# EAGLE schematic 1203_054 (EAGLE 7.1.0)

## Sheet 1 of 2
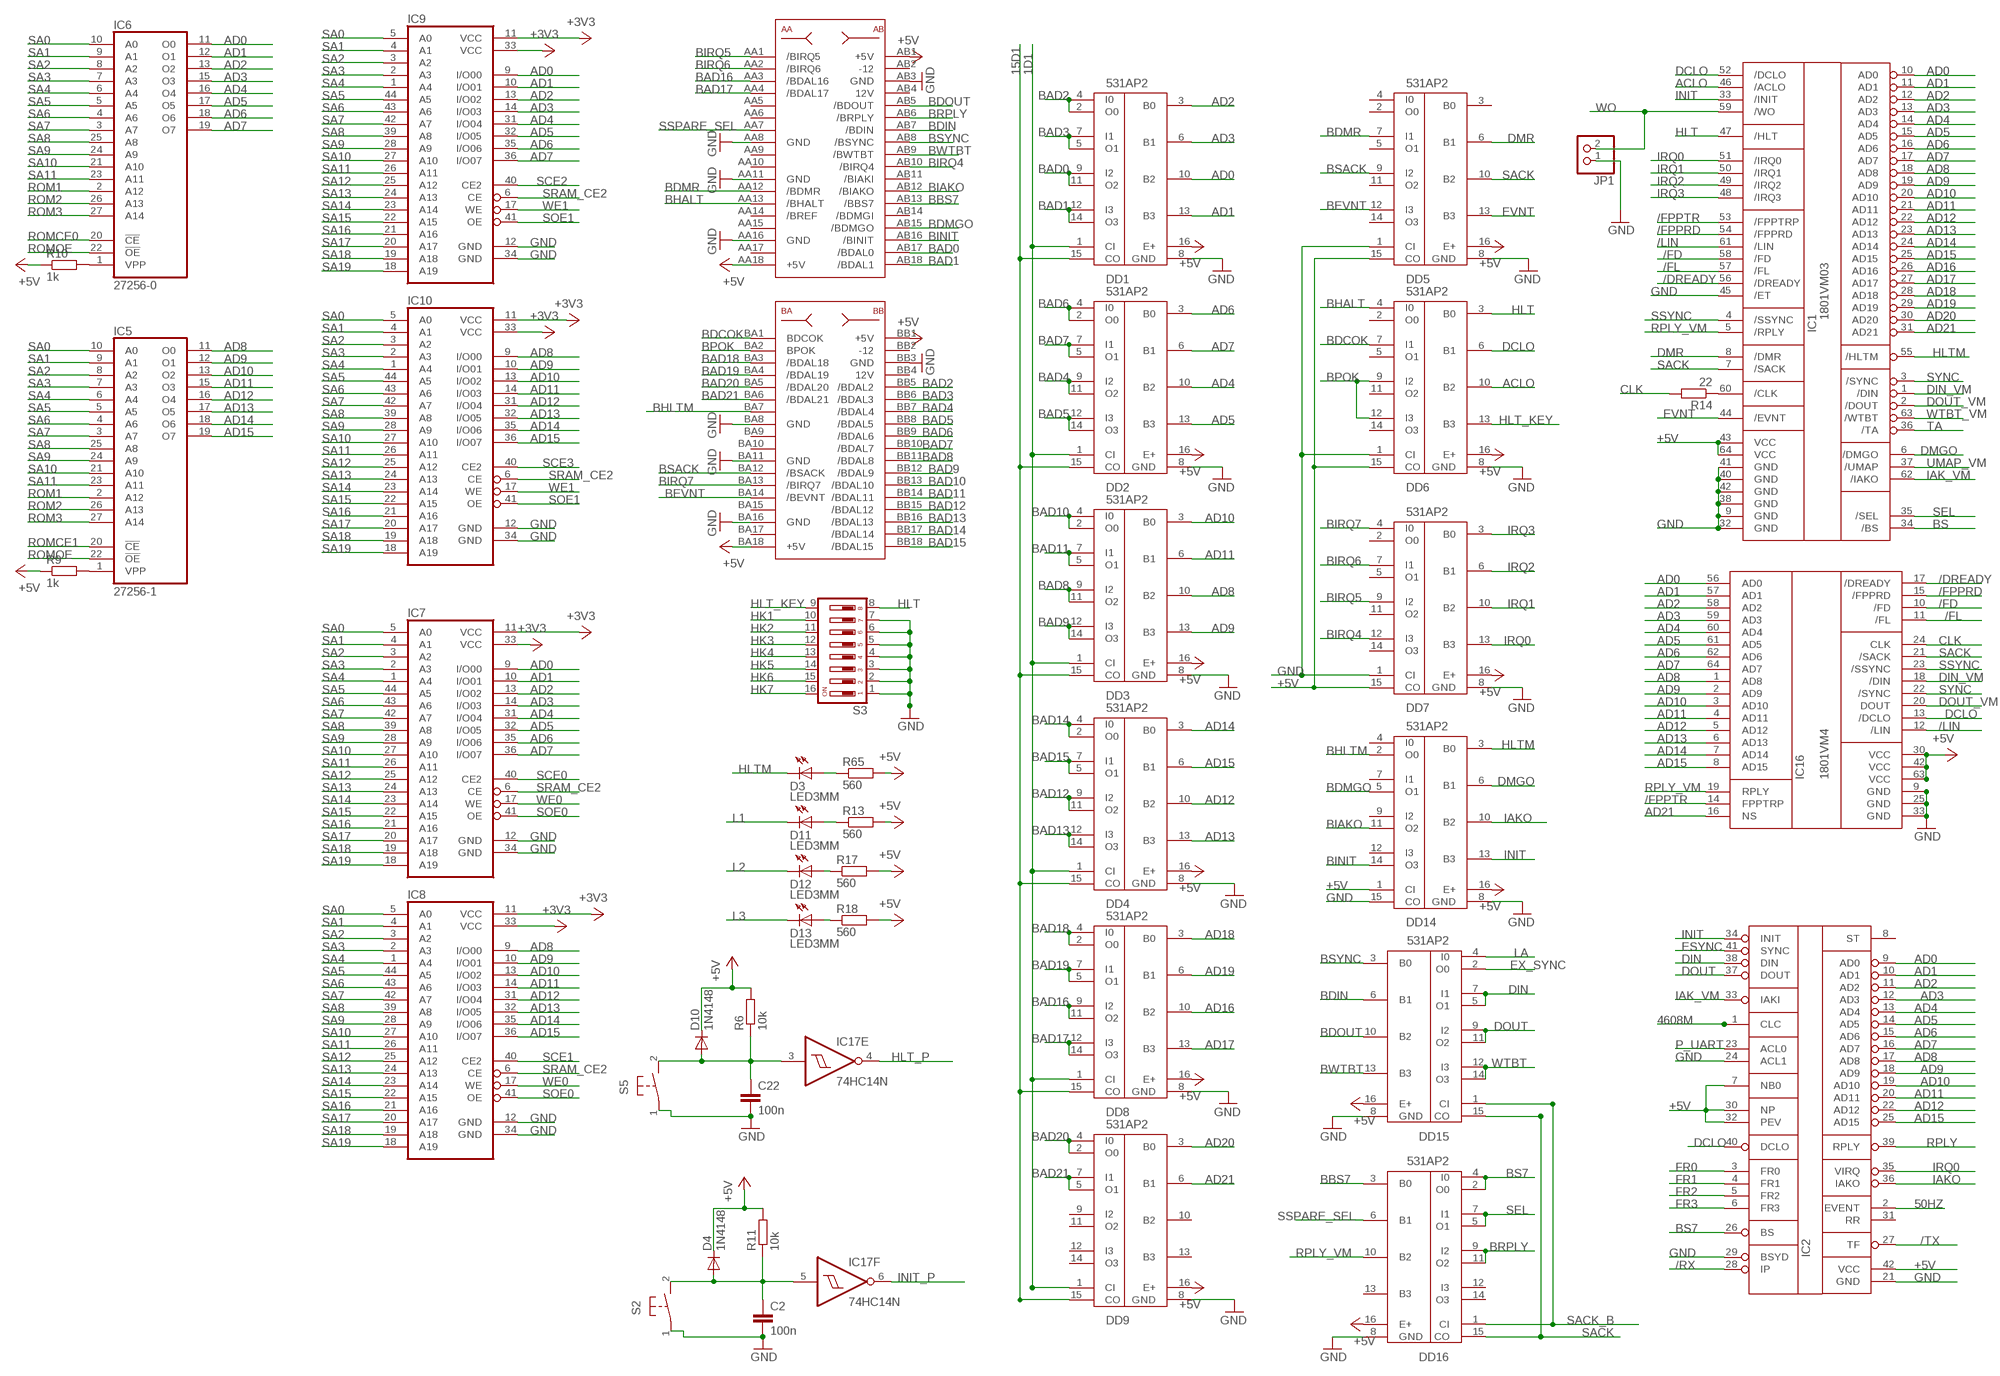
[diagram p0: schematic, sheet 1, part 1 of 2]
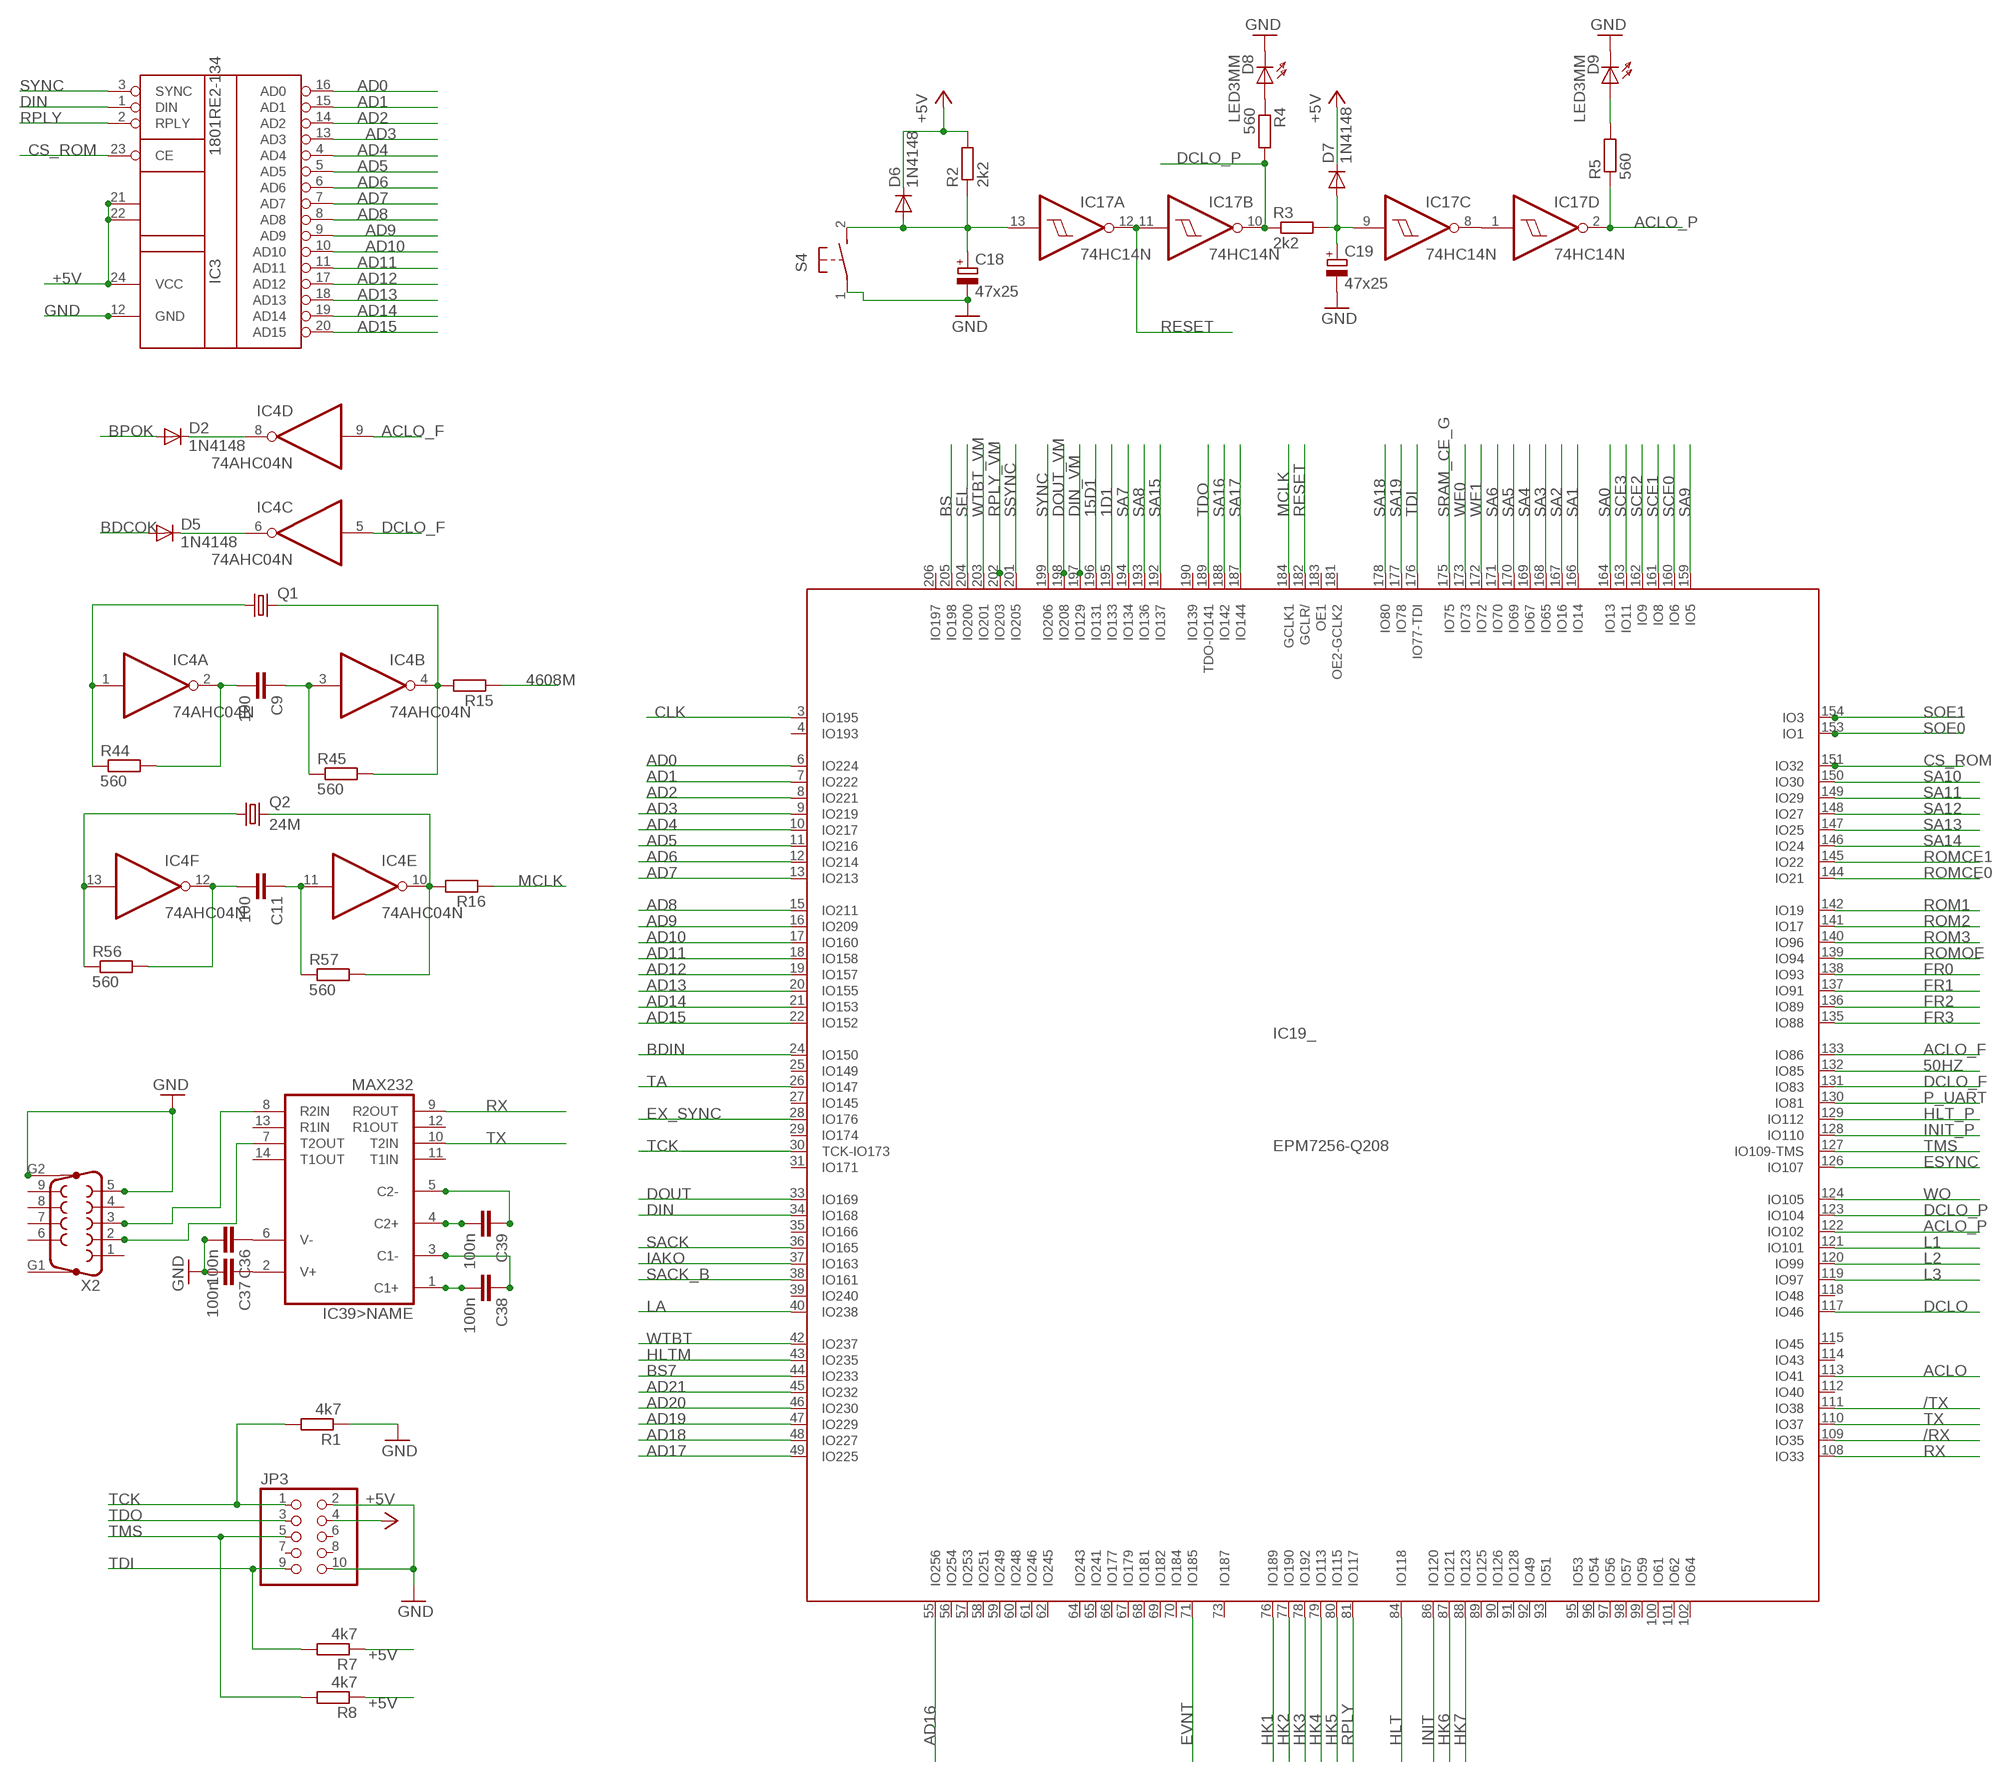
[diagram p1: schematic, sheet 1, part 2 of 2]

### Parts
C2  100n  C-EU050-024X044  [C050-024X044]
C9  100  C-EU025-024X044  [C025-024X044]
C11  100  C-EU025-024X044  [C025-024X044]
C18  47x25  CPOL-EUE2.5-5  [E2,5-5]
C19  47x25  CPOL-EUE2.5-5  [E2,5-5]
C22  100n  C-EU050-024X044  [C050-024X044]
C36  100n  C-EU025-024X044  [C025-024X044]
C37  100n  C-EU025-024X044  [C025-024X044]
C38  100n  C-EU025-024X044  [C025-024X044]
C39  100n  C-EU025-024X044  [C025-024X044]
D2  1N4148  [DO35-10]
D3  LED3MM  [LED3MM]
D4  1N4148  [DO35-10]
D5  1N4148  [DO35-10]
D6  1N4148  [DO35-10]
D7  1N4148  [DO35-10]
D8  LED3MM  [LED3MM]
D9  LED3MM  [LED3MM]
D10  1N4148  [DO35-10]
D11  LED3MM  [LED3MM]
D12  LED3MM  [LED3MM]
D13  LED3MM  [LED3MM]
DD1  531AP2  [DIL16]
DD2  531AP2  [DIL16]
DD3  531AP2  [DIL16]
DD4  531AP2  [DIL16]
DD5  531AP2  [DIL16]
DD6  531AP2  [DIL16]
DD7  531AP2  [DIL16]
DD8  531AP2  [DIL16]
DD9  531AP2  [DIL16]
DD14  531AP2  [DIL16]
DD15  531AP2  [DIL16]
DD16  531AP2  [DIL16]
IC1  1801VM03  1801M03  [DIL64]
IC2  1801VP1-065  [1801]
IC3  1801RE2-134  1801RE2  [DIL24]
IC4  74AHC04N  74ALS05N  [DIL14]
IC5  27256-1  27256  [DIL28]
IC6  27256-0  27256  [DIL28]
IC7  AS6C800855Z  [TSOP44]
IC8  AS6C800855Z  [TSOP44]
IC9  AS6C800855Z  [TSOP44]
IC10  AS6C800855Z  [TSOP44]
IC16  1801VM4  [1801VM4]
IC17  74HC14N  74AC14N  [DIL14]
IC19  EPM7256-Q208  [RQFP208]
IC39  MAX232  [DIL16]
JP1  PINHD-1X2  [1X02]
JP3  PINHD-2X5  [2X05]
Q1  HC49U70  [HC49U70]
Q2  24M  HC49U70  [HC49U70]
R1  4k7  R-EU_M0805  [M0805]
R2  2k2  R-EU_0207/10  [0207/10]
R3  2k2  R-EU_0207/10  [0207/10]
R4  560  R-EU_M0805  [M0805]
R5  560  R-EU_M0805  [M0805]
R6  10k  R-EU_0207/10  [0207/10]
R7  4k7  R-EU_M0805  [M0805]
R8  4k7  R-EU_M0805  [M0805]
R9  1k  R-EU_M0805  [M0805]
R10  1k  R-EU_M0805  [M0805]
R11  10k  R-EU_0207/10  [0207/10]
R13  560  R-EU_M0805  [M0805]
R14  22  R-EU_0204/2V  [0204V]
R15  R-EU_0204/2V  [0204V]
R16  R-EU_0204/2V  [0204V]
R17  560  R-EU_M0805  [M0805]
R18  560  R-EU_M0805  [M0805]
R44  560  R-EU_0204/2V  [0204V]
R45  560  R-EU_0204/2V  [0204V]
R56  560  R-EU_0204/2V  [0204V]
R57  560  R-EU_0204/2V  [0204V]
R65  560  R-EU_M0805  [M0805]
S2  31-XX  [B3F-31XX]
S3  DP08  [DP-08]
S4  31-XX  [B3F-31XX]
S5  31-XX  [B3F-31XX]
X2  F09HP  [F09HP]
XP1  CON1  [CON1]

### Nets
1D1: DD1.1(CI) DD2.1(CI) DD3.1(CI) DD4.1(CI) DD8.1(CI) DD9.1(CI) IC19.195(_:IO133) ; also sheet 2
15D1: DD1.15(CO) DD2.15(CO) DD3.15(CO) DD4.15(CO) DD8.15(CO) DD9.15(CO) IC19.196(_:IO131)
50HZ: IC2.2(EVENT) IC19.132(_:IO85)
4608M: IC2.1(CLC) R15.1
4608MM: IC4.10(E:O) Q2.2 R16.2 R57.2
+3V3: IC7.11(VCC) IC7.33(VCC) IC8.11(VCC) IC8.33(VCC) IC9.11(VCC) IC9.33(VCC) IC10.11(VCC) IC10.33(VCC) ; also sheet 2
+5V: D4.K(C) D6.K(C) D7.K(C) D10.K(C) DD1.16(E+) DD2.16(E+) DD3.16(E+) DD4.16(E+) DD5.15(CO) DD5.16(E+) DD6.15(CO) DD6.16(E+) DD7.15(CO) DD7.16(E+) DD8.16(E+) DD9.16(E+) DD14.1(CI) DD14.16(E+) DD15.16(E+) DD16.16(E+) IC1.43(VCC) IC1.64(VCC) IC2.7(NB0) IC2.30(NP) IC2.32(PEV) IC2.42(VCC) IC3.21(F0) IC3.22(F1) IC3.24(VCC) IC16.30(VCC) IC16.42(VCC) IC16.63(VCC) JP3.4 R2.2 R6.2 R7.1 R8.1 R9.1 R10.1 R11.2 R13.2 R17.2 R18.2 R65.2 XP1.AA18(+5V) XP1.AB1(+5V) XP1.BA18(+5V) XP1.BB1(+5V) ; also sheet 2
/DREADY: IC1.56(/DREADY) IC16.17(/DREADY) ; also sheet 2
/FD: IC1.58(/FD) IC16.10(/FD) ; also sheet 2
/FL: IC1.57(/FL) IC16.11(/FL) ; also sheet 2
/FPPRD: IC1.54(/FPPRD) IC16.15(/FPPRD) ; also sheet 2
/FPPTR: IC1.53(/FPPTRP) IC16.14(FPPTRP) ; also sheet 2
/LIN: IC1.61(/LIN) IC16.12(/LIN) ; also sheet 2
/RX: IC2.28(IP) IC19.109(_:IO35)
/TX: IC2.27(TF) IC19.111(_:IO38)
ACLO: DD6.10(B2) IC1.46(/ACLO) IC19.113(_:IO41) ; also sheet 2
ACLO_F: IC4.9(D:I) IC19.133(_:IO86)
ACLO_P: IC17.2(D:O) IC19.122(_:IO102) R5.1
AD0: DD1.10(B2) IC1.10(AD0) IC2.9(AD0) IC3.16(AD0) IC6.11(O0) IC7.9(I/O00) IC9.9(I/O00) IC16.56(AD0) IC19.6(_:IO224) ; also sheet 2
AD1: DD1.13(B3) IC1.11(AD1) IC2.10(AD1) IC3.15(AD1) IC6.12(O1) IC7.10(I/O01) IC9.10(I/O01) IC16.57(AD1) IC19.7(_:IO222) ; also sheet 2
AD2: DD1.3(B0) IC1.12(AD2) IC2.11(AD2) IC3.14(AD2) IC6.13(O2) IC7.13(I/O02) IC9.13(I/O02) IC16.58(AD2) IC19.8(_:IO221) ; also sheet 2
AD3: DD1.6(B1) IC1.13(AD3) IC2.12(AD3) IC3.13(AD3) IC6.15(O3) IC7.14(I/O03) IC9.14(I/O03) IC16.59(AD3) IC19.9(_:IO219) ; also sheet 2
AD4: DD2.10(B2) IC1.14(AD4) IC2.13(AD4) IC3.4(AD4) IC6.16(O4) IC7.31(I/O04) IC9.31(I/O04) IC16.60(AD4) IC19.10(_:IO217) ; also sheet 2
AD5: DD2.13(B3) IC1.15(AD5) IC2.14(AD5) IC3.5(AD5) IC6.17(O5) IC7.32(I/O05) IC9.32(I/O05) IC16.61(AD5) IC19.11(_:IO216) ; also sheet 2
AD6: DD2.3(B0) IC1.16(AD6) IC2.15(AD6) IC3.6(AD6) IC6.18(O6) IC7.35(I/O06) IC9.35(I/O06) IC16.62(AD6) IC19.12(_:IO214) ; also sheet 2
AD7: DD2.6(B1) IC1.17(AD7) IC2.16(AD7) IC3.7(AD7) IC6.19(O7) IC7.36(I/O07) IC9.36(I/O07) IC16.64(AD7) IC19.13(_:IO213) ; also sheet 2
AD8: DD3.10(B2) IC1.18(AD8) IC2.17(AD8) IC3.8(AD8) IC5.11(O0) IC8.9(I/O00) IC10.9(I/O00) IC16.1(AD8) IC19.15(_:IO211) ; also sheet 2
AD9: DD3.13(B3) IC1.19(AD9) IC2.18(AD9) IC3.9(AD9) IC5.12(O1) IC8.10(I/O01) IC10.10(I/O01) IC16.2(AD9) IC19.16(_:IO209) ; also sheet 2
AD10: DD3.3(B0) IC1.20(AD10) IC2.19(AD10) IC3.10(AD10) IC5.13(O2) IC8.13(I/O02) IC10.13(I/O02) IC16.3(AD10) IC19.17(_:IO160) ; also sheet 2
AD11: DD3.6(B1) IC1.21(AD11) IC2.20(AD11) IC3.11(AD11) IC5.15(O3) IC8.14(I/O03) IC10.14(I/O03) IC16.4(AD11) IC19.18(_:IO158) ; also sheet 2
AD12: DD4.10(B2) IC1.22(AD12) IC2.22(AD12) IC3.17(AD12) IC5.16(O4) IC8.31(I/O04) IC10.31(I/O04) IC16.5(AD12) IC19.19(_:IO157) ; also sheet 2
AD13: DD4.13(B3) IC1.23(AD13) IC3.18(AD13) IC5.17(O5) IC8.32(I/O05) IC10.32(I/O05) IC16.6(AD13) IC19.20(_:IO155) ; also sheet 2
AD14: DD4.3(B0) IC1.24(AD14) IC3.19(AD14) IC5.18(O6) IC8.35(I/O06) IC10.35(I/O06) IC16.7(AD14) IC19.21(_:IO153) ; also sheet 2
AD15: DD4.6(B1) IC1.25(AD15) IC2.25(AD15) IC3.20(AD15) IC5.19(O7) IC8.36(I/O07) IC10.36(I/O07) IC16.8(AD15) IC19.22(_:IO152) ; also sheet 2
AD16: DD8.10(B2) IC1.26(AD16) IC19.55(_:IO256) ; also sheet 2
AD17: DD8.13(B3) IC1.27(AD17) IC19.49(_:IO225) ; also sheet 2
AD18: DD8.3(B0) IC1.28(AD18) IC19.48(_:IO227) ; also sheet 2
AD19: DD8.6(B1) IC1.29(AD19) IC19.47(_:IO229) ; also sheet 2
AD20: DD9.3(B0) IC1.30(AD20) IC19.46(_:IO230) ; also sheet 2
AD21: DD9.6(B1) IC1.31(AD21) IC16.16(NS) IC19.45(_:IO232) ; also sheet 2
BAD0: DD1.9(I2) DD1.11(O2) XP1.AB17(/BDAL0) ; also sheet 2
BAD1: DD1.12(I3) DD1.14(O3) XP1.AB18(/BDAL1) ; also sheet 2
BAD2: DD1.2(O0) DD1.4(I0) XP1.BB5(/BDAL2) ; also sheet 2
BAD3: DD1.5(O1) DD1.7(I1) XP1.BB6(/BDAL3) ; also sheet 2
BAD4: DD2.9(I2) DD2.11(O2) XP1.BB7(/BDAL4) ; also sheet 2
BAD5: DD2.12(I3) DD2.14(O3) XP1.BB8(/BDAL5) ; also sheet 2
BAD6: DD2.2(O0) DD2.4(I0) XP1.BB9(/BDAL6) ; also sheet 2
BAD7: DD2.5(O1) DD2.7(I1) XP1.BB10(/BDAL7) ; also sheet 2
BAD8: DD3.9(I2) DD3.11(O2) XP1.BB11(/BDAL8) ; also sheet 2
BAD9: DD3.12(I3) DD3.14(O3) XP1.BB12(/BDAL9) ; also sheet 2
BAD10: DD3.2(O0) DD3.4(I0) XP1.BB13(/BDAL10) ; also sheet 2
BAD11: DD3.5(O1) DD3.7(I1) XP1.BB14(/BDAL11) ; also sheet 2
BAD12: DD4.9(I2) DD4.11(O2) XP1.BB15(/BDAL12) ; also sheet 2
BAD13: DD4.12(I3) DD4.14(O3) XP1.BB16(/BDAL13) ; also sheet 2
BAD14: DD4.2(O0) DD4.4(I0) XP1.BB17(/BDAL14) ; also sheet 2
BAD15: DD4.5(O1) DD4.7(I1) XP1.BB18(/BDAL15) ; also sheet 2
BAD16: DD8.9(I2) DD8.11(O2) XP1.AA3(/BDAL16) ; also sheet 2
BAD17: DD8.12(I3) DD8.14(O3) XP1.AA4(/BDAL17) ; also sheet 2
BAD18: DD8.2(O0) DD8.4(I0) XP1.BA3(/BDAL18) ; also sheet 2
BAD19: DD8.5(O1) DD8.7(I1) XP1.BA4(/BDAL19) ; also sheet 2
BAD20: DD9.2(O0) DD9.4(I0) XP1.BA5(/BDAL20) ; also sheet 2
BAD21: DD9.5(O1) DD9.7(I1) XP1.BA6(/BDAL21) ; also sheet 2
BBS7: DD16.3(B0) XP1.AB13(/BBS7) ; also sheet 2
BDCOK: D5.A DD6.7(I1) XP1.BA1(BDCOK) ; also sheet 2
BDIN: DD15.6(B1) IC19.24(_:IO150) XP1.AB7(/BDIN) ; also sheet 2
BDMGO: DD14.5(O1) XP1.AB15(/BDMGO) ; also sheet 2
BDMR: DD5.7(I1) XP1.AA12(/BDMR) ; also sheet 2
BDOUT: DD15.10(B2) XP1.AB5(/BDOUT) ; also sheet 2
BEVNT: DD5.12(I3) XP1.BA14(/BEVNT) ; also sheet 2
BHALT: DD6.4(I0) XP1.AA13(/BHALT) ; also sheet 2
BHLTM: DD14.2(O0) XP1.BA7 ; also sheet 2
BIAKO: DD14.11(O2) XP1.AB12(/BIAKO) ; also sheet 2
BINIT: DD14.14(O3) XP1.AB16(/BINIT) ; also sheet 2
BIRQ4: DD7.12(I3) XP1.AB10(/BIRQ4) ; also sheet 2
BIRQ5: DD7.9(I2) XP1.AA1(/BIRQ5) ; also sheet 2
BIRQ6: DD7.7(I1) XP1.AA2(/BIRQ6) ; also sheet 2
BIRQ7: DD7.4(I0) XP1.BA13(/BIRQ7) ; also sheet 2
BPOK: D2.A DD6.9(I2) DD6.12(I3) XP1.BA2(BPOK) ; also sheet 2
BRPLY: DD16.9(I2) DD16.11(O2) XP1.AB6(/BRPLY) ; also sheet 2
BS: IC1.34(/BS) IC19.205(_:IO198) ; also sheet 2
BS7: DD16.2(O0) DD16.4(I0) IC2.26(BS) IC19.44(_:IO233) ; also sheet 2
BSACK: DD5.9(I2) XP1.BA12(/BSACK) ; also sheet 2
BSYNC: DD15.3(B0) XP1.AB8(/BSYNC) ; also sheet 2
BWTBT: DD15.13(B3) XP1.AB9(/BWTBT) ; also sheet 2
CLK: IC16.24(CLK) IC19.3(_:IO195) R14.2
CS_ROM: IC3.23(CE) IC19.151(_:IO32)
DCLO: DD6.6(B1) IC1.52(/DCLO) IC2.40(DCLO) IC16.13(/DCLO) IC19.117(_:IO46) ; also sheet 2
DCLO_F: IC4.5(C:I) IC19.131(_:IO83)
DCLO_P: IC17.10(B:O) IC19.123(_:IO104) R3.1 R4.2
DIN: DD15.5(O1) DD15.7(I1) IC2.38(DIN) IC3.1(DIN) IC19.34(_:IO168) ; also sheet 2
DIN_VM: IC1.1(/DIN) IC16.18(/DIN) IC19.197(_:IO129) ; also sheet 2
DMGO: DD14.6(B1) IC1.6(/DMGO) ; also sheet 2
DMR: DD5.6(B1) IC1.8(/DMR) ; also sheet 2
DOUT: DD15.9(I2) DD15.11(O2) IC2.37(DOUT) IC19.33(_:IO169) ; also sheet 2
DOUT_VM: IC1.2(/DOUT) IC16.20(DOUT) IC19.198(_:IO208) ; also sheet 2
ESYNC: IC2.41(SYNC) IC19.126(_:IO107)
EVNT: DD5.13(B3) IC1.44(/EVNT) IC19.71(_:IO185) ; also sheet 2
EX_SYNC: DD15.2(O0) IC19.28(_:IO176) ; also sheet 2
FR0: IC2.3(FR0) IC19.138(_:IO93)
FR1: IC2.4(FR1) IC19.137(_:IO91)
FR2: IC2.5(FR2) IC19.136(_:IO89)
FR3: IC2.6(FR3) IC19.135(_:IO88)
GND: C2.2 C18.- C19.- C22.2 C36.2 C37.2 D8.K(C) D9.K(C) DD1.8(GND) DD2.8(GND) DD3.8(GND) DD4.8(GND) DD5.1(CI) DD5.8(GND) DD6.1(CI) DD6.8(GND) DD7.1(CI) DD7.8(GND) DD8.8(GND) DD9.8(GND) DD14.8(GND) DD14.15(CO) DD15.8(GND) DD16.8(GND) IC1.9(GND) IC1.32(GND) IC1.38(GND) IC1.40(GND) IC1.41(GND) IC1.42(GND) IC1.45(/ET) IC2.21(GND) IC2.24(ACL1) IC2.29(BSYD) IC3.12(GND) IC7.12(GND) IC7.34(GND) IC8.12(GND) IC8.34(GND) IC9.12(GND) IC9.34(GND) IC10.12(GND) IC10.34(GND) IC16.9(GND) IC16.25(GND) IC16.33(GND) JP1.1 JP3.2 JP3.10 R1.1 S2.1 S3.1 S3.2 S3.3 S3.4 S3.5 S3.6 S3.7 S4.1 S5.1 X2.5 X2.G2 XP1.AA8(GND) XP1.AA11(GND) XP1.AA16(GND) XP1.AB3(GND) XP1.BA8(GND) XP1.BA11(GND) XP1.BA16(GND) XP1.BB3(GND) ; also sheet 2
HK1: IC19.76(_:IO189) S3.10 ; also sheet 2
HK2: IC19.77(_:IO190) S3.11 ; also sheet 2
HK3: IC19.78(_:IO192) S3.12 ; also sheet 2
HK4: IC19.79(_:IO113) S3.13 ; also sheet 2
HK5: IC19.80(_:IO115) S3.14 ; also sheet 2
HK6: IC19.87(_:IO121) S3.15 ; also sheet 2
HK7: IC19.88(_:IO123) S3.16 ; also sheet 2
HLT: DD6.3(B0) IC1.47(/HLT) IC19.84(_:IO118) S3.8 ; also sheet 2
HLT_KEY: DD6.13(B3) S3.9
HLT_P: IC17.4(E:O) IC19.129(_:IO112)
HLTM: D3.K(C) DD14.3(B0) IC1.55(/HLTM) IC19.43(_:IO235) ; also sheet 2
IAK_VM: IC1.62(/IAKO) IC2.33(IAKI) ; also sheet 2
IAKO: DD14.10(B2) IC2.36(IAKO) IC19.37(_:IO163)
INIT: DD14.13(B3) IC1.33(/INIT) IC2.34(INIT) IC19.86(_:IO120) ; also sheet 2
INIT_P: IC17.6(F:O) IC19.128(_:IO110)
IRQ0: DD7.13(B3) IC1.51(/IRQ0) IC2.35(VIRQ) ; also sheet 2
IRQ1: DD7.10(B2) IC1.50(/IRQ1) ; also sheet 2
IRQ2: DD7.6(B1) IC1.49(/IRQ2) ; also sheet 2
IRQ3: DD7.3(B0) IC1.48(/IRQ3) ; also sheet 2
L1: D11.K(C) IC19.121(_:IO101)
L2: D12.K(C) IC19.120(_:IO99)
L3: D13.K(C) IC19.119(_:IO97)
LA: DD15.4(I0) IC19.40(_:IO238)
MCLK: IC19.184(_:GCLK1) R16.1
MCLKK: IC4.4(B:O) Q1.2 R15.2 R45.2
N$2: IC6.1(VPP) R10.2
N$3: IC17.1(D:I) IC17.8(C:O)
N$4: C38.1 IC39.3(>NAME:C1-)
N$5: D9.A R5.2
N$6: C18.+ D6.A IC17.13(A:I) R2.1 S4.2
N$7: IC4.1(A:I) Q1.1 R44.1
N$8: D3.A R65.1
N$82: C9.2 IC4.2(A:O) R44.2
N$83: C19.+ D7.A IC17.9(C:I) R3.2
N$84: D8.A R4.1
N$85: IC5.1(VPP) R9.2
N$86: C22.1 D10.A IC17.3(E:I) R6.1 S5.2
N$87: D11.A R13.1
N$88: IC1.60(/CLK) R14.1
N$90: D2.K(C) IC4.8(D:O)
N$91: D5.K(C) IC4.6(C:O)
N$92: C2.1 D4.A IC17.5(F:I) R11.1 S2.2
N$93: D12.A R17.1
N$94: D13.A R18.1
N$96: IC4.13(F:I) Q2.1 R56.1
N$127: C9.1 IC4.3(B:I) R45.1
N$136: C38.2 IC39.1(>NAME:C1+)
N$139: C39.2 IC39.4(>NAME:C2+)
N$140: C39.1 IC39.5(>NAME:C2-)
N$141: IC39.7(>NAME:T2OUT) X2.2
N$142: IC39.8(>NAME:R2IN) X2.3
N$143: C36.1 IC39.6(>NAME:V-)
N$144: C37.1 IC39.2(>NAME:V+)
N$148: C11.2 IC4.12(F:O) R56.2
N$149: C11.1 IC4.11(E:I) R57.1
P_UART: IC2.23(ACL0) IC19.130(_:IO81)
RESET: IC17.11(B:I) IC17.12(A:O) IC19.182(_:GCLR/)
ROM1: IC5.2(A12) IC6.2(A12) IC19.142(_:IO19)
ROM2: IC5.26(A13) IC6.26(A13) IC19.141(_:IO17)
ROM3: IC5.27(A14) IC6.27(A14) IC19.140(_:IO96)
ROMCE0: IC6.20(!CE) IC19.144(_:IO21)
ROMCE1: IC5.20(!CE) IC19.145(_:IO22)
ROMOE: IC5.22(!OE) IC6.22(!OE) IC19.139(_:IO94)
RPLY: IC2.39(RPLY) IC3.2(RPLY) IC19.81(_:IO117) ; also sheet 2
RPLY_VM: DD16.10(B2) IC1.5(/RPLY) IC16.19(RPLY) IC19.202(_:IO203) ; also sheet 2
RX: IC19.108(_:IO33) IC39.9(>NAME:R2OUT)
SA0: IC5.10(A0) IC6.10(A0) IC7.5(A0) IC8.5(A0) IC9.5(A0) IC10.5(A0) IC19.164(_:IO13)
SA1: IC5.9(A1) IC6.9(A1) IC7.4(A1) IC8.4(A1) IC9.4(A1) IC10.4(A1) IC19.166(_:IO14)
SA2: IC5.8(A2) IC6.8(A2) IC7.3(A2) IC8.3(A2) IC9.3(A2) IC10.3(A2) IC19.167(_:IO16)
SA3: IC5.7(A3) IC6.7(A3) IC7.2(A3) IC8.2(A3) IC9.2(A3) IC10.2(A3) IC19.168(_:IO65)
SA4: IC5.6(A4) IC6.6(A4) IC7.1(A4) IC8.1(A4) IC9.1(A4) IC10.1(A4) IC19.169(_:IO67)
SA5: IC5.5(A5) IC6.5(A5) IC7.44(A5) IC8.44(A5) IC9.44(A5) IC10.44(A5) IC19.170(_:IO69)
SA6: IC5.4(A6) IC6.4(A6) IC7.43(A6) IC8.43(A6) IC9.43(A6) IC10.43(A6) IC19.171(_:IO70)
SA7: IC5.3(A7) IC6.3(A7) IC7.42(A7) IC8.42(A7) IC9.42(A7) IC10.42(A7) IC19.194(_:IO134)
SA8: IC5.25(A8) IC6.25(A8) IC7.39(A8) IC8.39(A8) IC9.39(A8) IC10.39(A8) IC19.193(_:IO136)
SA9: IC5.24(A9) IC6.24(A9) IC7.28(A9) IC8.28(A9) IC9.28(A9) IC10.28(A9) IC19.159(_:IO5)
SA10: IC5.21(A10) IC6.21(A10) IC7.27(A10) IC8.27(A10) IC9.27(A10) IC10.27(A10) IC19.150(_:IO30)
SA11: IC5.23(A11) IC6.23(A11) IC7.26(A11) IC8.26(A11) IC9.26(A11) IC10.26(A11) IC19.149(_:IO29)
SA12: IC7.25(A12) IC8.25(A12) IC9.25(A12) IC10.25(A12) IC19.148(_:IO27)
SA13: IC7.24(A13) IC8.24(A13) IC9.24(A13) IC10.24(A13) IC19.147(_:IO25)
SA14: IC7.23(A14) IC8.23(A14) IC9.23(A14) IC10.23(A14) IC19.146(_:IO24)
SA15: IC7.22(A15) IC8.22(A15) IC9.22(A15) IC10.22(A15) IC19.192(_:IO137)
SA16: IC7.21(A16) IC8.21(A16) IC9.21(A16) IC10.21(A16) IC19.188(_:IO142)
SA17: IC7.20(A17) IC8.20(A17) IC9.20(A17) IC10.20(A17) IC19.187(_:IO144)
SA18: IC7.19(A18) IC8.19(A18) IC9.19(A18) IC10.19(A18) IC19.178(_:IO80)
SA19: IC7.18(A19) IC8.18(A19) IC9.18(A19) IC10.18(A19) IC19.177(_:IO78)
SACK: DD5.10(B2) DD15.15(CO) DD16.15(CO) IC1.7(/SACK) IC16.21(/SACK) IC19.36(_:IO165) ; also sheet 2
SACK_B: DD15.1(CI) DD16.1(CI) IC19.38(_:IO161)
SCE0: IC7.40(CE2) IC19.160(_:IO6)
SCE1: IC8.40(CE2) IC19.161(_:IO8)
SCE2: IC9.40(CE2) IC19.162(_:IO9)
SCE3: IC10.40(CE2) IC19.163(_:IO11)
SEL: DD16.5(O1) DD16.7(I1) IC1.35(/SEL) IC19.204(_:IO200) ; also sheet 2
SOE0: IC7.41(OE) IC8.41(OE) IC19.153(_:IO1)
SOE1: IC9.41(OE) IC10.41(OE) IC19.154(_:IO3)
SRAM_CE2: IC7.6(CE) IC8.6(CE) IC9.6(CE) IC10.6(CE) ; also sheet 2
SRAM_CE_G: IC19.175(_:IO75) ; also sheet 2
SSPARE_SEL: DD16.6(B1) XP1.AA7 ; also sheet 2
SSYNC: IC1.4(/SSYNC) IC16.23(/SSYNC) IC19.201(_:IO205) ; also sheet 2
SYNC: IC1.3(/SYNC) IC3.3(SYNC) IC16.22(/SYNC) IC19.199(_:IO206) ; also sheet 2
TA: IC1.36(/TA) IC19.26(_:IO147) ; also sheet 2
TCK: IC19.30(_:TCK-IO173) JP3.1 R1.2
TDI: IC19.176(_:IO77-TDI) JP3.9 R7.2
TDO: IC19.189(_:TDO-IO141) JP3.3
TMS: IC19.127(_:IO109-TMS) JP3.5 R8.2
TX: IC19.110(_:IO37) IC39.10(>NAME:T2IN)
UMAP_VM: IC1.37(/UMAP) ; also sheet 2
WE0: IC7.17(WE) IC8.17(WE) IC19.173(_:IO73)
WE1: IC9.17(WE) IC10.17(WE) IC19.172(_:IO72)
WO: IC1.59(/WO) IC19.124(_:IO105) JP1.2 ; also sheet 2
WTBT: DD15.12(I3) DD15.14(O3) IC19.42(_:IO237) ; also sheet 2
WTBT_VM: IC1.63(/WTBT) IC19.203(_:IO201) ; also sheet 2
Unconnected: DD5.2(O0) DD5.3(B0) DD5.4(I0) DD5.5(O1) DD5.11(O2) DD5.14(O3) DD6.2(O0) DD6.5(O1) DD6.11(O2) DD6.14(O3) DD7.2(O0) DD7.5(O1) DD7.11(O2) DD7.14(O3) DD9.9(I2) DD9.10(B2) DD9.11(O2) DD9.12(I3) DD9.13(B3) DD9.14(O3) DD14.4(I0) DD14.7(I1) DD14.9(I2) DD14.12(I3) DD16.12(I3) DD16.13(B3) DD16.14(O3) IC2.8(ST) IC2.31(RR) IC19.1(NC1:NC) IC19.2(NC2:NC) IC19.4(_:IO193) IC19.25(_:IO149) IC19.27(_:IO145) IC19.29(_:IO174) IC19.31(_:IO171) IC19.35(_:IO166) IC19.39(_:IO240) IC19.51(NC3:NC) IC19.52(NC4:NC) IC19.53(NC5:NC) IC19.54(NC6:NC) IC19.56(_:IO254) IC19.57(_:IO253) IC19.58(_:IO251) IC19.59(_:IO249) IC19.60(_:IO248) IC19.61(_:IO246) IC19.62(_:IO245) IC19.64(_:IO243) IC19.65(_:IO241) IC19.66(_:IO177) IC19.67(_:IO179) IC19.68(_:IO181) IC19.69(_:IO182) IC19.70(_:IO184) IC19.73(_:IO187) IC19.89(_:IO125) IC19.90(_:IO126) IC19.91(_:IO128) IC19.92(_:IO49) IC19.93(_:IO51) IC19.95(_:IO53) IC19.96(_:IO54) IC19.97(_:IO56) IC19.98(_:IO57) IC19.99(_:IO59) IC19.100(_:IO61) IC19.101(_:IO62) IC19.102(_:IO64) IC19.103(NC7:NC) IC19.104(NC8:NC) IC19.105(NC9:NC) IC19.106(NC10:NC) IC19.112(_:IO40) IC19.114(_:IO43) IC19.115(_:IO45) IC19.118(_:IO48) IC19.155(NC11:NC) IC19.156(NC12:NC) IC19.157(NC13:NC) IC19.158(NC14:NC) IC19.181(_:OE2-GCLK2) IC19.183(_:OE1) IC19.190(_:IO139) IC19.206(_:IO197) IC19.207(NC15:NC) IC19.208(NC16:NC) IC39.11(>NAME:T1IN) IC39.12(>NAME:R1OUT) IC39.13(>NAME:R1IN) IC39.14(>NAME:T1OUT) IC39.15(P:GND) IC39.16(P:+5V) JP3.6 JP3.7 JP3.8 X2.1 X2.4 X2.6 X2.7 X2.8 X2.9 X2.G1 XP1.AA5 XP1.AA6 XP1.AA9 XP1.AA10 XP1.AA14(/BREF) XP1.AA15 XP1.AA17 XP1.AB2(-12) XP1.AB4(12V) XP1.AB11(/BIAKI) XP1.AB14(/BDMGI) XP1.BA9 XP1.BA10 XP1.BA15 XP1.BA17 XP1.BB2(-12) XP1.BB4(12V)

## Sheet 2 of 2
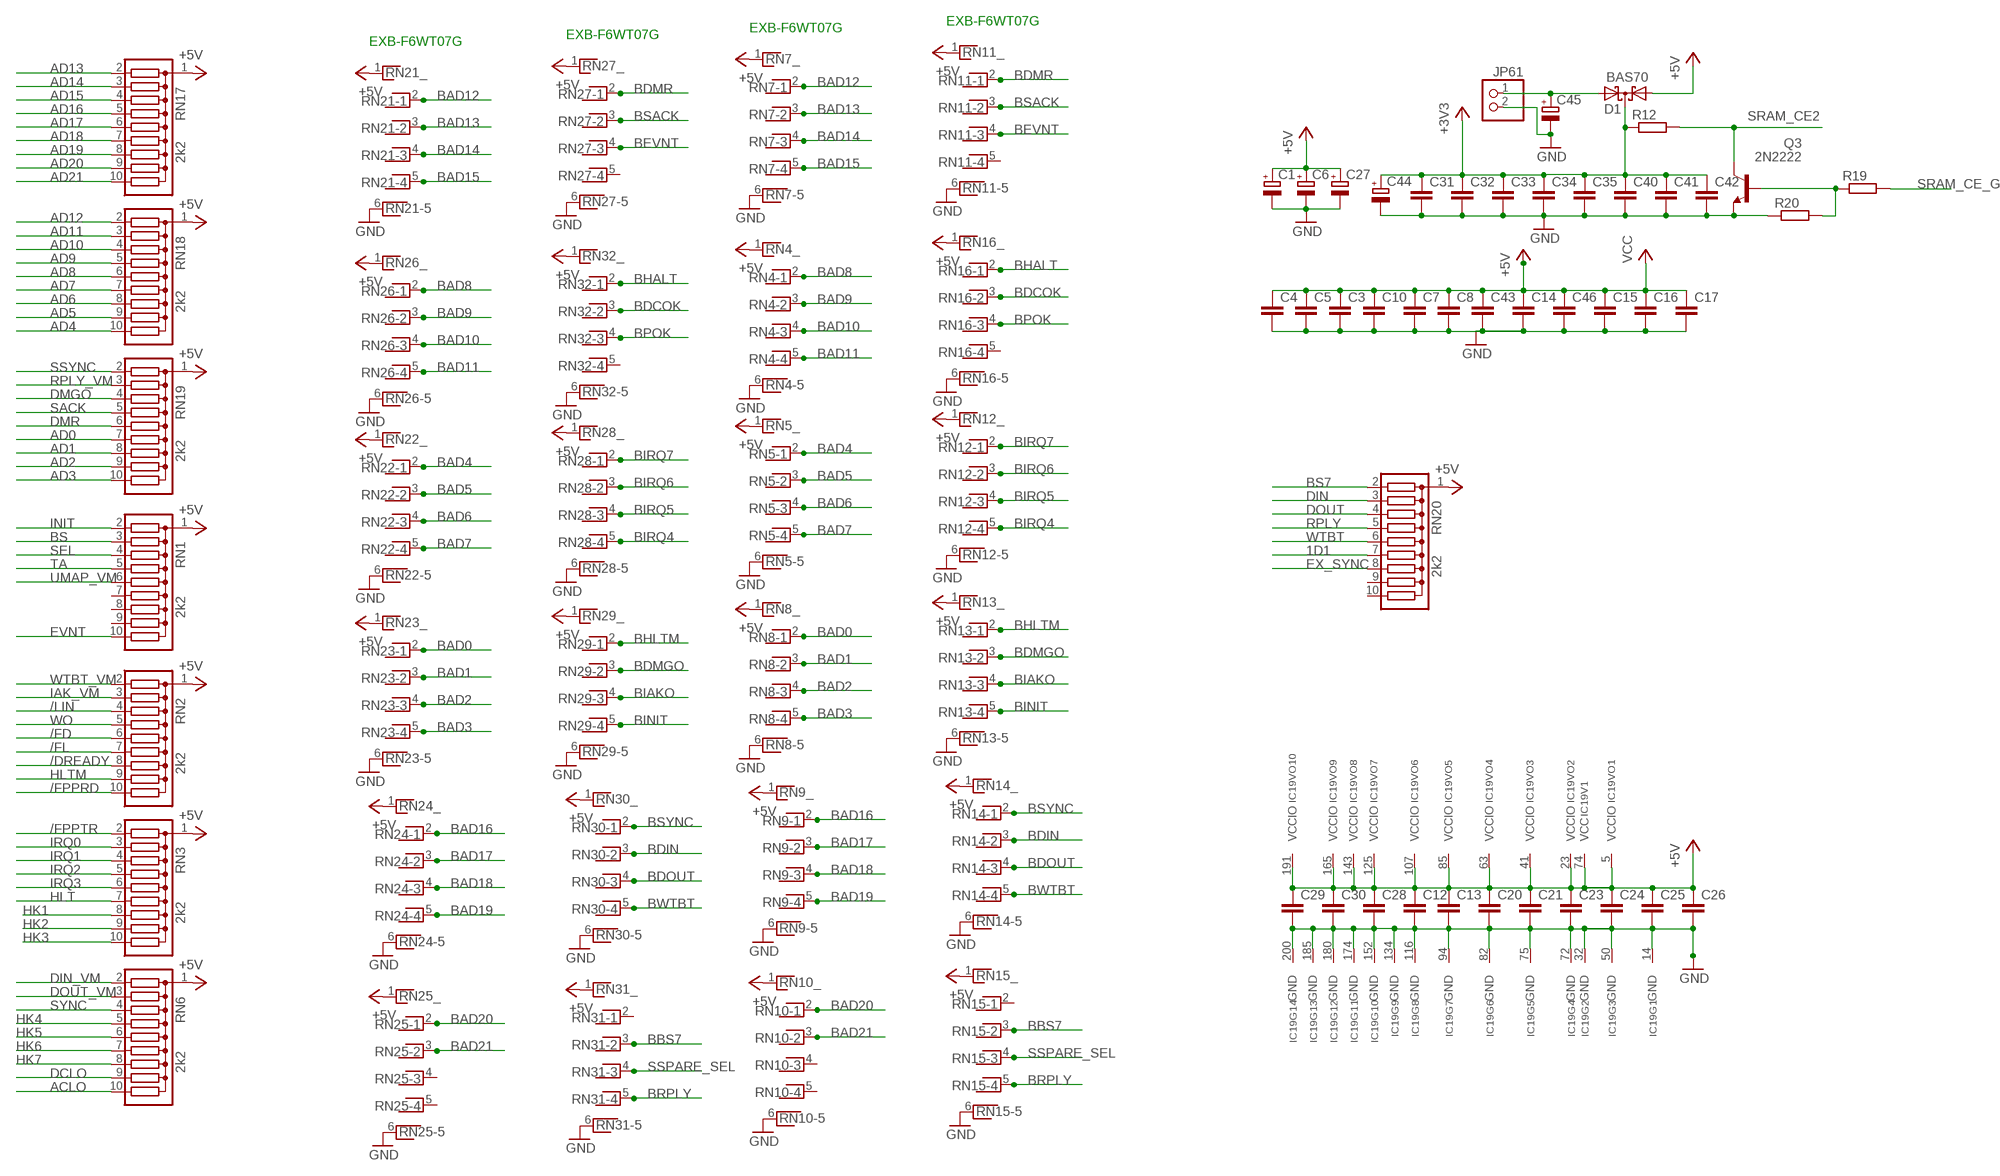
[diagram p2: schematic, sheet 2]

### Parts
C1  CPOL-EUCT6032  [CT6032]
C3  C-EU050-024X044  [C050-024X044]
C4  C-EU050-024X044  [C050-024X044]
C5  C-EU050-024X044  [C050-024X044]
C6  CPOL-EUCT6032  [CT6032]
C7  C-EU050-024X044  [C050-024X044]
C8  C-EU050-024X044  [C050-024X044]
C10  C-EU050-024X044  [C050-024X044]
C12  C-EUC0805  [C0805]
C13  C-EUC0805  [C0805]
C14  C-EU050-024X044  [C050-024X044]
C15  C-EU050-024X044  [C050-024X044]
C16  C-EU050-024X044  [C050-024X044]
C17  C-EU050-024X044  [C050-024X044]
C20  C-EUC0805  [C0805]
C21  C-EUC0805  [C0805]
C23  C-EU050-024X044  [C050-024X044]
C24  C-EU050-024X044  [C050-024X044]
C25  C-EU050-024X044  [C050-024X044]
C26  C-EU050-024X044  [C050-024X044]
C27  CPOL-EUCT6032  [CT6032]
C28  C-EU050-024X044  [C050-024X044]
C29  C-EU050-024X044  [C050-024X044]
C30  C-EU050-024X044  [C050-024X044]
C31  C-EUC0603  [C0603]
C32  C-EUC0603  [C0603]
C33  C-EUC0603  [C0603]
C34  C-EUC0603  [C0603]
C35  C-EUC0603  [C0603]
C40  C-EUC0603  [C0603]
C41  C-EUC0603  [C0603]
C42  C-EUC0603  [C0603]
C43  C-EU050-024X044  [C050-024X044]
C44  CPOL-EUCT7343  [CT7343]
C45  CPOL-EUCT7343  [CT7343]
C46  C-EU050-024X044  [C050-024X044]
D1  BAS70  BAS70-05  [SOT23]
JP61  PINHD-1X2  [1X02]
Q3  2N2222  [TO18]
R12  R-EU_M0805  [M0805]
R19  R-EU_M0805  [M0805]
R20  R-EU_M0805  [M0805]
RN1  2k2  G09R  [SIL10]
RN2  2k2  G09R  [SIL10]
RN3  2k2  G09R  [SIL10]
RN4  RNX5  [RN-6]
RN5  RNX5  [RN-6]
RN6  2k2  G09R  [SIL10]
RN7  RNX5  [RN-6]
RN8  RNX5  [RN-6]
RN9  RNX5  [RN-6]
RN10  RNX5  [RN-6]
RN11  RNX5  [RN-6]
RN12  RNX5  [RN-6]
RN13  RNX5  [RN-6]
RN14  RNX5  [RN-6]
RN15  RNX5  [RN-6]
RN16  RNX5  [RN-6]
RN17  2k2  G09R  [SIL10]
RN18  2k2  G09R  [SIL10]
RN19  2k2  G09R  [SIL10]
RN20  2k2  G09R  [SIL10]
RN21  RNX5  [RN-6]
RN22  RNX5  [RN-6]
RN23  RNX5  [RN-6]
RN24  RNX5  [RN-6]
RN25  RNX5  [RN-6]
RN26  RNX5  [RN-6]
RN27  RNX5  [RN-6]
RN28  RNX5  [RN-6]
RN29  RNX5  [RN-6]
RN30  RNX5  [RN-6]
RN31  RNX5  [RN-6]
RN32  RNX5  [RN-6]

### Nets
1D1: RN20.7 ; also sheet 1
+3V3: C31.1 C32.1 C33.1 C34.1 C35.1 C40.1 C41.1 C42.1 C44.+ D1.3(C) R12.1 ; also sheet 1
+5V: C1.+ C3.1 C4.1 C5.1 C6.+ C7.1 C8.1 C10.1 C12.1 C13.1 C14.1 C15.1 C16.1 C17.1 C20.1 C21.1 C23.1 C24.1 C25.1 C26.1 C27.+ C28.1 C29.1 C30.1 C43.1 C46.1 D1.1(A1) IC19.5(VO1:VCCIO) IC19.23(VO2:VCCIO) IC19.41(VO3:VCCIO) IC19.63(VO4:VCCIO) IC19.74(V1:VCC) IC19.85(VO5:VCCIO) IC19.107(VO6:VCCIO) IC19.125(VO7:VCCIO) IC19.143(VO8:VCCIO) IC19.165(VO9:VCCIO) IC19.191(VO10:VCCIO) RN1.1 RN2.1 RN3.1 RN4.1 RN5.1 RN6.1 RN7.1 RN8.1 RN9.1 RN10.1 RN11.1 RN12.1 RN13.1 RN14.1 RN15.1 RN16.1 RN17.1 RN18.1 RN19.1 RN20.1 RN21.1 RN22.1 RN23.1 RN24.1 RN25.1 RN26.1 RN27.1 RN28.1 RN29.1 RN30.1 RN31.1 RN32.1 ; supply symbol labelled VCC ; also sheet 1
/DREADY: RN2.8 ; also sheet 1
/FD: RN2.6 ; also sheet 1
/FL: RN2.7 ; also sheet 1
/FPPRD: RN2.10 ; also sheet 1
/FPPTR: RN3.2 ; also sheet 1
/LIN: RN2.4 ; also sheet 1
ACLO: RN6.10 ; also sheet 1
AD0: RN19.7 ; also sheet 1
AD1: RN19.8 ; also sheet 1
AD2: RN19.9 ; also sheet 1
AD3: RN19.10 ; also sheet 1
AD4: RN18.10 ; also sheet 1
AD5: RN18.9 ; also sheet 1
AD6: RN18.8 ; also sheet 1
AD7: RN18.7 ; also sheet 1
AD8: RN18.6 ; also sheet 1
AD9: RN18.5 ; also sheet 1
AD10: RN18.4 ; also sheet 1
AD11: RN18.3 ; also sheet 1
AD12: RN18.2 ; also sheet 1
AD13: RN17.2 ; also sheet 1
AD14: RN17.3 ; also sheet 1
AD15: RN17.4 ; also sheet 1
AD16: RN17.5 ; also sheet 1
AD17: RN17.6 ; also sheet 1
AD18: RN17.7 ; also sheet 1
AD19: RN17.8 ; also sheet 1
AD20: RN17.9 ; also sheet 1
AD21: RN17.10 ; also sheet 1
BAD0: RN8.2 RN23.2 ; also sheet 1
BAD1: RN8.3 RN23.3 ; also sheet 1
BAD2: RN8.4 RN23.4 ; also sheet 1
BAD3: RN8.5 RN23.5 ; also sheet 1
BAD4: RN5.2 RN22.2 ; also sheet 1
BAD5: RN5.3 RN22.3 ; also sheet 1
BAD6: RN5.4 RN22.4 ; also sheet 1
BAD7: RN5.5 RN22.5 ; also sheet 1
BAD8: RN4.2 RN26.2 ; also sheet 1
BAD9: RN4.3 RN26.3 ; also sheet 1
BAD10: RN4.4 RN26.4 ; also sheet 1
BAD11: RN4.5 RN26.5 ; also sheet 1
BAD12: RN7.2 RN21.2 ; also sheet 1
BAD13: RN7.3 RN21.3 ; also sheet 1
BAD14: RN7.4 RN21.4 ; also sheet 1
BAD15: RN7.5 RN21.5 ; also sheet 1
BAD16: RN9.2 RN24.2 ; also sheet 1
BAD17: RN9.3 RN24.3 ; also sheet 1
BAD18: RN9.4 RN24.4 ; also sheet 1
BAD19: RN9.5 RN24.5 ; also sheet 1
BAD20: RN10.2 RN25.2 ; also sheet 1
BAD21: RN10.3 RN25.3 ; also sheet 1
BBS7: RN15.3 RN31.3 ; also sheet 1
BDCOK: RN16.3 RN32.3 ; also sheet 1
BDIN: RN14.3 RN30.3 ; also sheet 1
BDMGO: RN13.3 RN29.3 ; also sheet 1
BDMR: RN11.2 RN27.2 ; also sheet 1
BDOUT: RN14.4 RN30.4 ; also sheet 1
BEVNT: RN11.4 RN27.4 ; also sheet 1
BHALT: RN16.2 RN32.2 ; also sheet 1
BHLTM: RN13.2 RN29.2 ; also sheet 1
BIAKO: RN13.4 RN29.4 ; also sheet 1
BINIT: RN13.5 RN29.5 ; also sheet 1
BIRQ4: RN12.5 RN28.5 ; also sheet 1
BIRQ5: RN12.4 RN28.4 ; also sheet 1
BIRQ6: RN12.3 RN28.3 ; also sheet 1
BIRQ7: RN12.2 RN28.2 ; also sheet 1
BPOK: RN16.4 RN32.4 ; also sheet 1
BRPLY: RN15.5 RN31.5 ; also sheet 1
BS: RN1.3 ; also sheet 1
BS7: RN20.2 ; also sheet 1
BSACK: RN11.3 RN27.3 ; also sheet 1
BSYNC: RN14.2 RN30.2 ; also sheet 1
BWTBT: RN14.5 RN30.5 ; also sheet 1
DCLO: RN6.9 ; also sheet 1
DIN: RN20.3 ; also sheet 1
DIN_VM: RN6.2 ; also sheet 1
DMGO: RN19.4 ; also sheet 1
DMR: RN19.6 ; also sheet 1
DOUT: RN20.4 ; also sheet 1
DOUT_VM: RN6.3 ; also sheet 1
EVNT: RN1.10 ; also sheet 1
EX_SYNC: RN20.8 ; also sheet 1
GND: C1.- C3.2 C4.2 C5.2 C6.- C7.2 C8.2 C10.2 C12.2 C13.2 C14.2 C15.2 C16.2 C17.2 C20.2 C21.2 C23.2 C24.2 C25.2 C26.2 C27.- C28.2 C29.2 C30.2 C31.2 C32.2 C33.2 C34.2 C35.2 C40.2 C41.2 C42.2 C43.2 C44.- C45.- C46.2 IC19.14(GND) IC19.32(GND) IC19.50(GND) IC19.72(GND) IC19.75(GND) IC19.82(GND) IC19.94(GND) IC19.116(GND) IC19.134(GND) IC19.152(GND) IC19.174(GND) IC19.180(GND) IC19.185(GND) IC19.200(GND) JP61.2 Q3.1(E) R20.1 RN4.6 RN5.6 RN7.6 RN8.6 RN9.6 RN10.6 RN11.6 RN12.6 RN13.6 RN14.6 RN15.6 RN16.6 RN21.6 RN22.6 RN23.6 RN24.6 RN25.6 RN26.6 RN27.6 RN28.6 RN29.6 RN30.6 RN31.6 RN32.6 ; also sheet 1
HK1: RN3.8 ; also sheet 1
HK2: RN3.9 ; also sheet 1
HK3: RN3.10 ; also sheet 1
HK4: RN6.5 ; also sheet 1
HK5: RN6.6 ; also sheet 1
HK6: RN6.7 ; also sheet 1
HK7: RN6.8 ; also sheet 1
HLT: RN3.7 ; also sheet 1
HLTM: RN2.9 ; also sheet 1
IAK_VM: RN2.3 ; also sheet 1
INIT: RN1.2 ; also sheet 1
IRQ0: RN3.3 ; also sheet 1
IRQ1: RN3.4 ; also sheet 1
IRQ2: RN3.5 ; also sheet 1
IRQ3: RN3.6 ; also sheet 1
N$1: C45.+ D1.2(A2) JP61.1
N$95: Q3.2(B) R19.1 R20.2
RPLY: RN20.5 ; also sheet 1
RPLY_VM: RN19.3 ; also sheet 1
SACK: RN19.5 ; also sheet 1
SEL: RN1.4 ; also sheet 1
SRAM_CE2: Q3.3(C) R12.2 ; also sheet 1
SRAM_CE_G: R19.2 ; also sheet 1
SSPARE_SEL: RN15.4 RN31.4 ; also sheet 1
SSYNC: RN19.2 ; also sheet 1
SYNC: RN6.4 ; also sheet 1
TA: RN1.5 ; also sheet 1
UMAP_VM: RN1.6 ; also sheet 1
WO: RN2.5 ; also sheet 1
WTBT: RN20.6 ; also sheet 1
WTBT_VM: RN2.2 ; also sheet 1
Unconnected: RN1.7 RN1.8 RN1.9 RN10.4 RN10.5 RN11.5 RN15.2 RN16.5 RN20.9 RN20.10 RN25.4 RN25.5 RN27.5 RN31.2 RN32.5

### Notes on the sheet
- EXB-F6WT07G
- EXB-F6WT07G
- EXB-F6WT07G
- EXB-F6WT07G

## Power pins joined to a net without a drawn wire
+5V: IC4.14(P:VCC) IC5.28(VCC) IC6.28(VCC) IC17.14(P:VCC) IC19.83(V2:VCC) IC19.179(V3:VCC) IC19.186(V4:VCC)
GND: IC4.7(P:GND) IC5.14(GND) IC6.14(GND) IC17.7(P:GND)

## Library data of the parts
C1 C6 C18 C19 C27 C44 C45 = rcl:CPOL-EU: POLARIZED CAPACITOR, European symbol
C2-C5 C7-C17 C20-C26 C28-C43 C46 = rcl:C-EU: CAPACITOR, European symbol
D1 = diode:BAS70-05: Silicon Schottky Diodes General-purpose diode for high-speed switching
D2 D4-D7 D10 = diode:1N4148: DIODE high speed (Philips)
D3 D8 D9 D11-D13 = led:LED3MM: LED 3 mm, round
DD1-DD9 DD14-DD16 = pdp_dvk:531AP2
IC1 = pdp_dvk:1801M03
IC2 = pdp_dvk:1801VP1-065
IC3 = pdp_dvk:1801RE2
IC4 = 74xx-eu:74*05: Hex INVERTER, open collector
IC5 IC6 = memory:27256: MEMORY
IC7-IC10 = pdp_dvk:AS6C8008
IC16 = pdp_dvk:1801VM4
IC17 = 74xx-eu:74*14: Hex schmitt trigger INVERTER
IC19 = altera:EPM7256-Q208: EPM7256S MAX 7000 family; MPN: EPM7256AEQC208-10N; OC_FARNELL: 1549440; OC_NEWARK: 51R9842
IC39 = maxim:MAX232: RS232 TRANSEIVER
JP1 JP61 = pinhead:PINHD-1X2: PIN HEADER
JP3 = pinhead:PINHD-2X5: PIN HEADER
Q1 Q2 = crystal:HC49U70: CRYSTAL
Q3 = transistor-npn:2N2222*: NPN Transistor
R1-R20 R44 R45 R56 R57 R65 = rcl:R-EU_: RESISTOR, European symbol
RN1-RN3 RN6 RN17-RN20 = resistor-sil:G09R: SIL RESISTOR; OC_FARNELL: unknown; OC_NEWARK: unknown
RN4 RN5 RN7-RN16 RN21-RN32 = resistor-net:RNX5: RESISTOR NETWORK; OC_FARNELL: unknown; OC_NEWARK: unknown
S2 S4 S5 = switch-omron:31-XX: OMRON SWITCH
S3 = switch-dil:DP08: DIL/CODE SWITCH; MPN: DP08; OC_FARNELL: 9471626; OC_NEWARK: 73J0035
X2 = con-subd:F09HP: HARTING SUB-D
XP1 = pdp_dvk:CON1